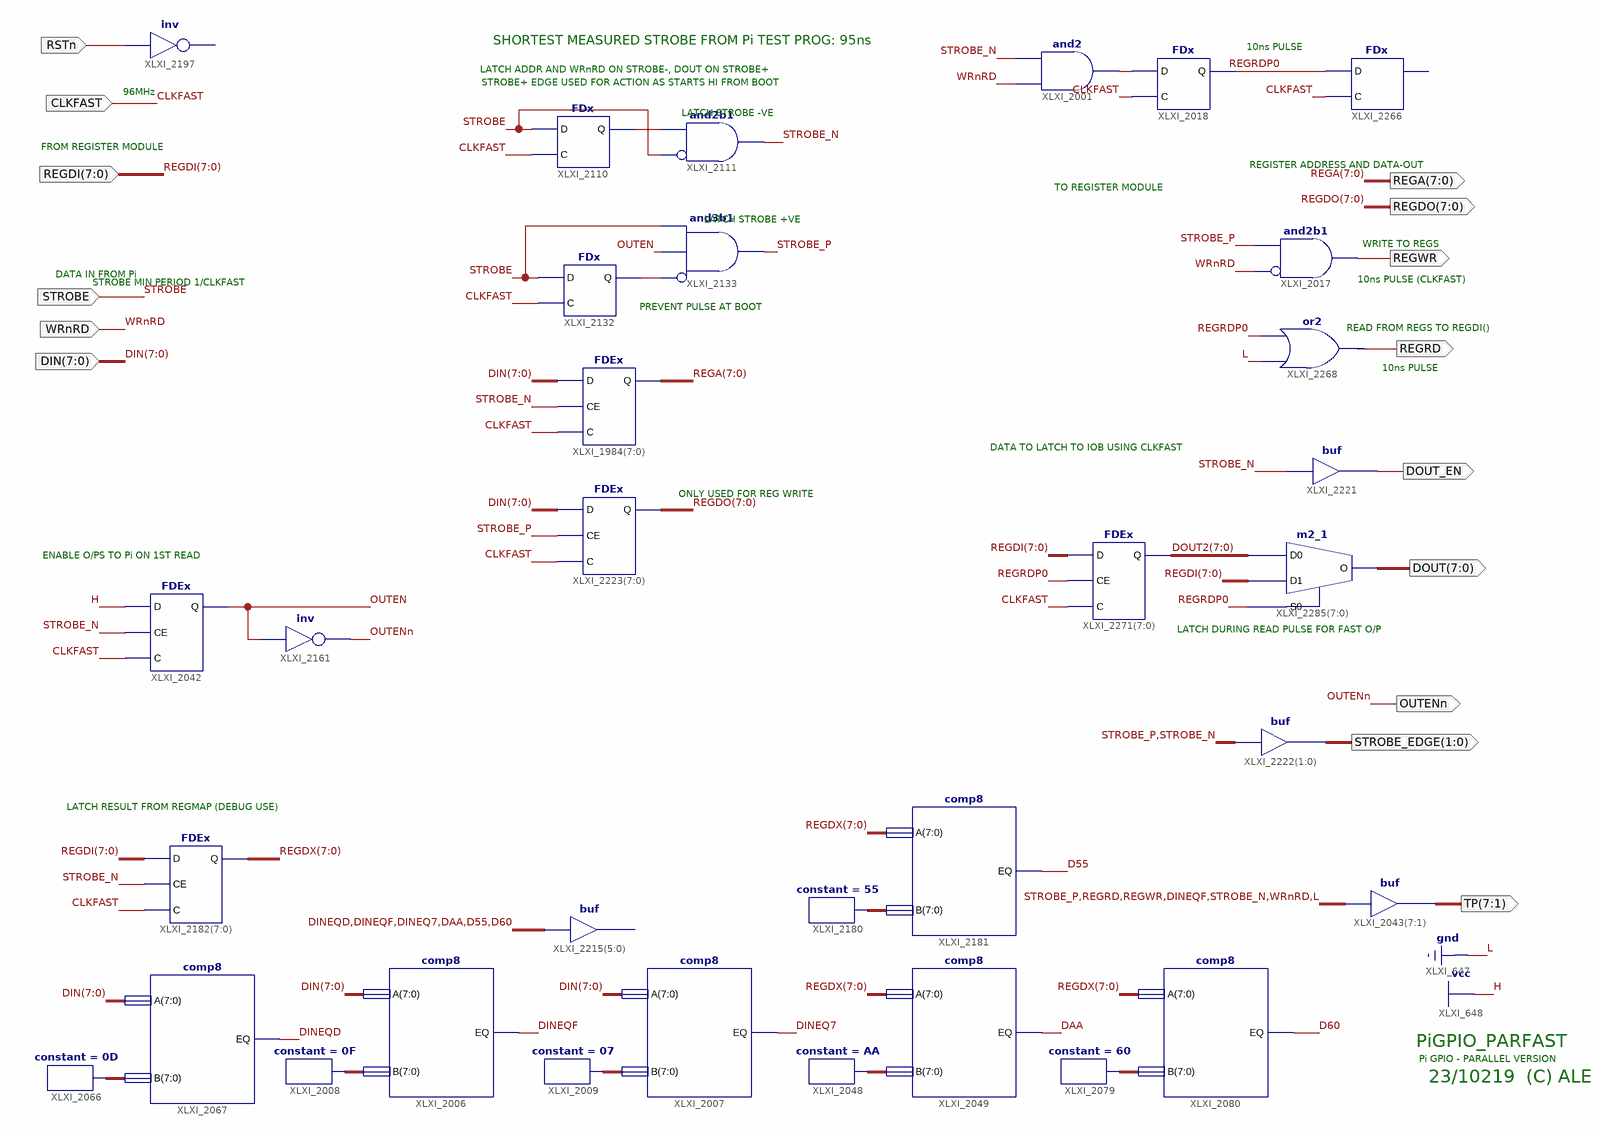
[diagram p0: schematic sheet 1]
// Xilinx ISE schematic PiGPIO_PARFAST.sch (spartan3e) as structural Verilog: 33 symbols, 15 ports
module PiGPIO_PARFAST (
  input  WRnRD,
  input  [7:0] DIN,
  input  STROBE,
  input  CLKFAST,
  input  RSTn,
  input  [7:0] REGDI,
  output [7:0] REGA,
  output [7:0] REGDO,
  output OUTENn,
  output [7:1] TP,
  output [1:0] STROBE_EDGE,
  output REGWR,
  output REGRD,
  output DOUT_EN,
  output [7:0] DOUT
);

  wire D55, D60, DAA, DINEQ7, DINEQD, DINEQF, OUTEN, REGRDP0, STROBE_N, STROBE_P, XLXN_2890, XLXN_3037,
       XLXN_3095;
  wire [7:0] DOUT2, REGDX, XLXN_122, XLXN_125, XLXN_2917, XLXN_2951, XLXN_2974, XLXN_3213;

  // inv XLXI_2197 has open pins: I=RSTn, O=open
  FDEx XLXI_2042 (.C(CLKFAST), .CE(STROBE_N), .D(1'b1), .Q(OUTEN));
  not XLXI_2161 (OUTENn, OUTEN);
  constant #(.CValue("07")) XLXI_2009 (.O(XLXN_125));
  constant #(.CValue("0F")) XLXI_2008 (.O(XLXN_122));
  comp8 XLXI_2007 (.A(DIN), .B(XLXN_125), .EQ(DINEQ7));
  comp8 XLXI_2006 (.A(DIN), .B(XLXN_122), .EQ(DINEQF));
  constant #(.CValue("AA")) XLXI_2048 (.O(XLXN_2917));
  comp8 XLXI_2049 (.A(REGDX), .B(XLXN_2917), .EQ(DAA));
  constant #(.CValue("0D")) XLXI_2066 (.O(XLXN_2951));
  comp8 XLXI_2067 (.A(DIN), .B(XLXN_2951), .EQ(DINEQD));
  constant #(.CValue("60")) XLXI_2079 (.O(XLXN_2974));
  comp8 XLXI_2080 (.A(REGDX), .B(XLXN_2974), .EQ(D60));
  // buf XLXI_2215[5..0] has open pins: I={DINEQD, DINEQF, DINEQ7, DAA, D55, D60}, O=open
  FDEx XLXI_2182[7:0] (.C(CLKFAST), .CE(STROBE_N), .D(REGDI), .Q(REGDX));
  constant #(.CValue("55")) XLXI_2180 (.O(XLXN_3213));
  comp8 XLXI_2181 (.A(REGDX), .B(XLXN_3213), .EQ(D55));
  assign TP = {STROBE_P, REGRD, REGWR, DINEQF, STROBE_N, WRnRD, 1'b0};  // buf XLXI_2043[7..1], 7 bits wide
  and XLXI_2001 (XLXN_2890, WRnRD, STROBE_N);
  FDx XLXI_2018 (.C(CLKFAST), .D(XLXN_2890), .Q(REGRDP0));
  assign STROBE_EDGE = {STROBE_P, STROBE_N};  // buf XLXI_2222[1..0], 2 bits wide
  FDx XLXI_2266 (.C(CLKFAST), .D(REGRDP0));  // open: Q
  and XLXI_2017 (REGWR, ~WRnRD, STROBE_P);  // and2b1
  or XLXI_2268 (REGRD, 1'b0, REGRDP0);
  buf XLXI_2221 (DOUT_EN, STROBE_N);
  FDx XLXI_2110 (.C(CLKFAST), .D(STROBE), .Q(XLXN_3037));
  and XLXI_2133 (STROBE_P, ~XLXN_3095, OUTEN, STROBE);  // and3b1
  FDx XLXI_2132 (.C(CLKFAST), .D(STROBE), .Q(XLXN_3095));
  and XLXI_2111 (STROBE_N, ~STROBE, XLXN_3037);  // and2b1
  FDEx XLXI_1984[7:0] (.C(CLKFAST), .CE(STROBE_N), .D(DIN), .Q(REGA));
  FDEx XLXI_2223[7:0] (.C(CLKFAST), .CE(STROBE_P), .D(DIN), .Q(REGDO));
  m2_1 XLXI_2285[7:0] (.D0(DOUT2), .D1(REGDI), .S0(REGRDP0), .O(DOUT));
  FDEx XLXI_2271[7:0] (.C(CLKFAST), .CE(REGRDP0), .D(REGDI), .Q(DOUT2));

  // Notes on the sheet:
  //   SHORTEST MEASURED STROBE FROM Pi TEST PROG: 95ns
  //   10ns PULSE
  //   LATCH ADDR AND WRnRD ON STROBE-, DOUT ON STROBE+
  //   STROBE+ EDGE USED FOR ACTION AS STARTS HI FROM BOOT
  //   96MHz
  //   LATCH STROBE -VE
  //   FROM REGISTER MODULE
  //   REGISTER ADDRESS AND DATA-OUT
  //   TO REGISTER MODULE
  //   LATCH STROBE +VE
  //   WRITE TO REGS
  //   DATA IN FROM Pi
  //   10ns PULSE (CLKFAST)
  //   STROBE MIN PERIOD 1/CLKFAST
  //   PREVENT PULSE AT BOOT
  //   READ FROM REGS TO REGDI()
  //   10ns PULSE
  //   DATA TO LATCH TO IOB USING CLKFAST
  //   ONLY USED FOR REG WRITE
  //   ENABLE O/PS TO Pi ON 1ST READ
  //   LATCH DURING READ PULSE FOR FAST O/P
  //   LATCH RESULT FROM REGMAP (DEBUG USE)
  //   PiGPIO_PARFAST
  //   Pi GPIO - PARALLEL VERSION
  //   23/10219  (C) ALE
endmodule
